# EAGLE schematic led16x16 (EAGLE 5.06)
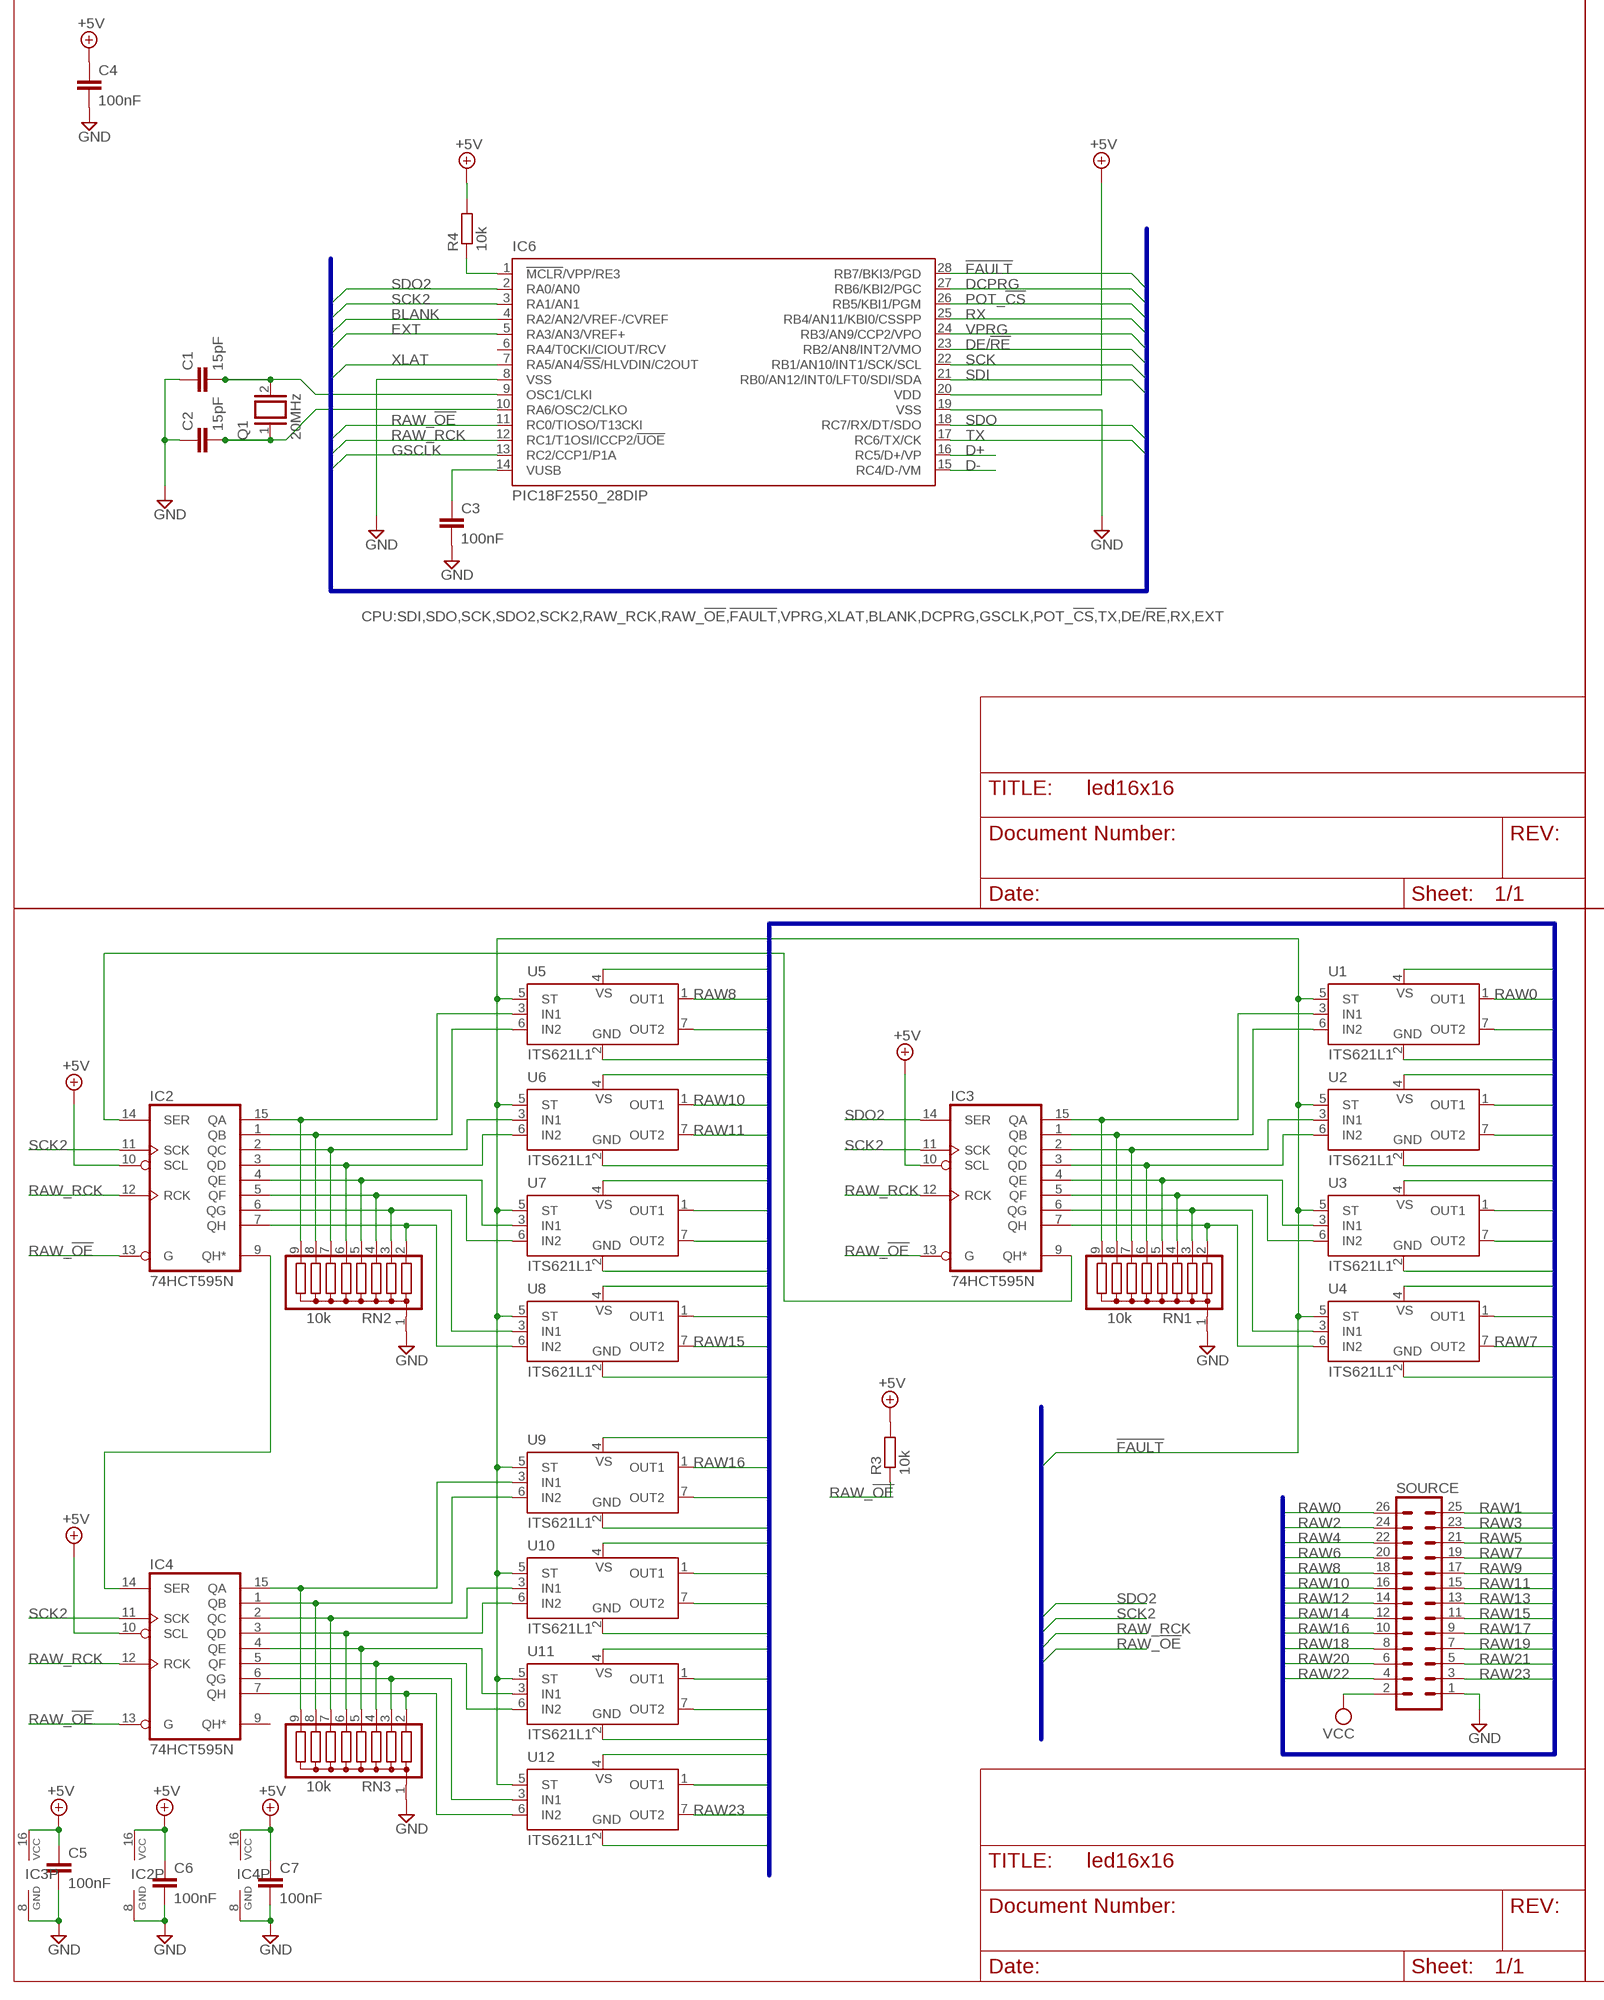
[diagram p0: schematic, sheet 1, part 1 of 2]
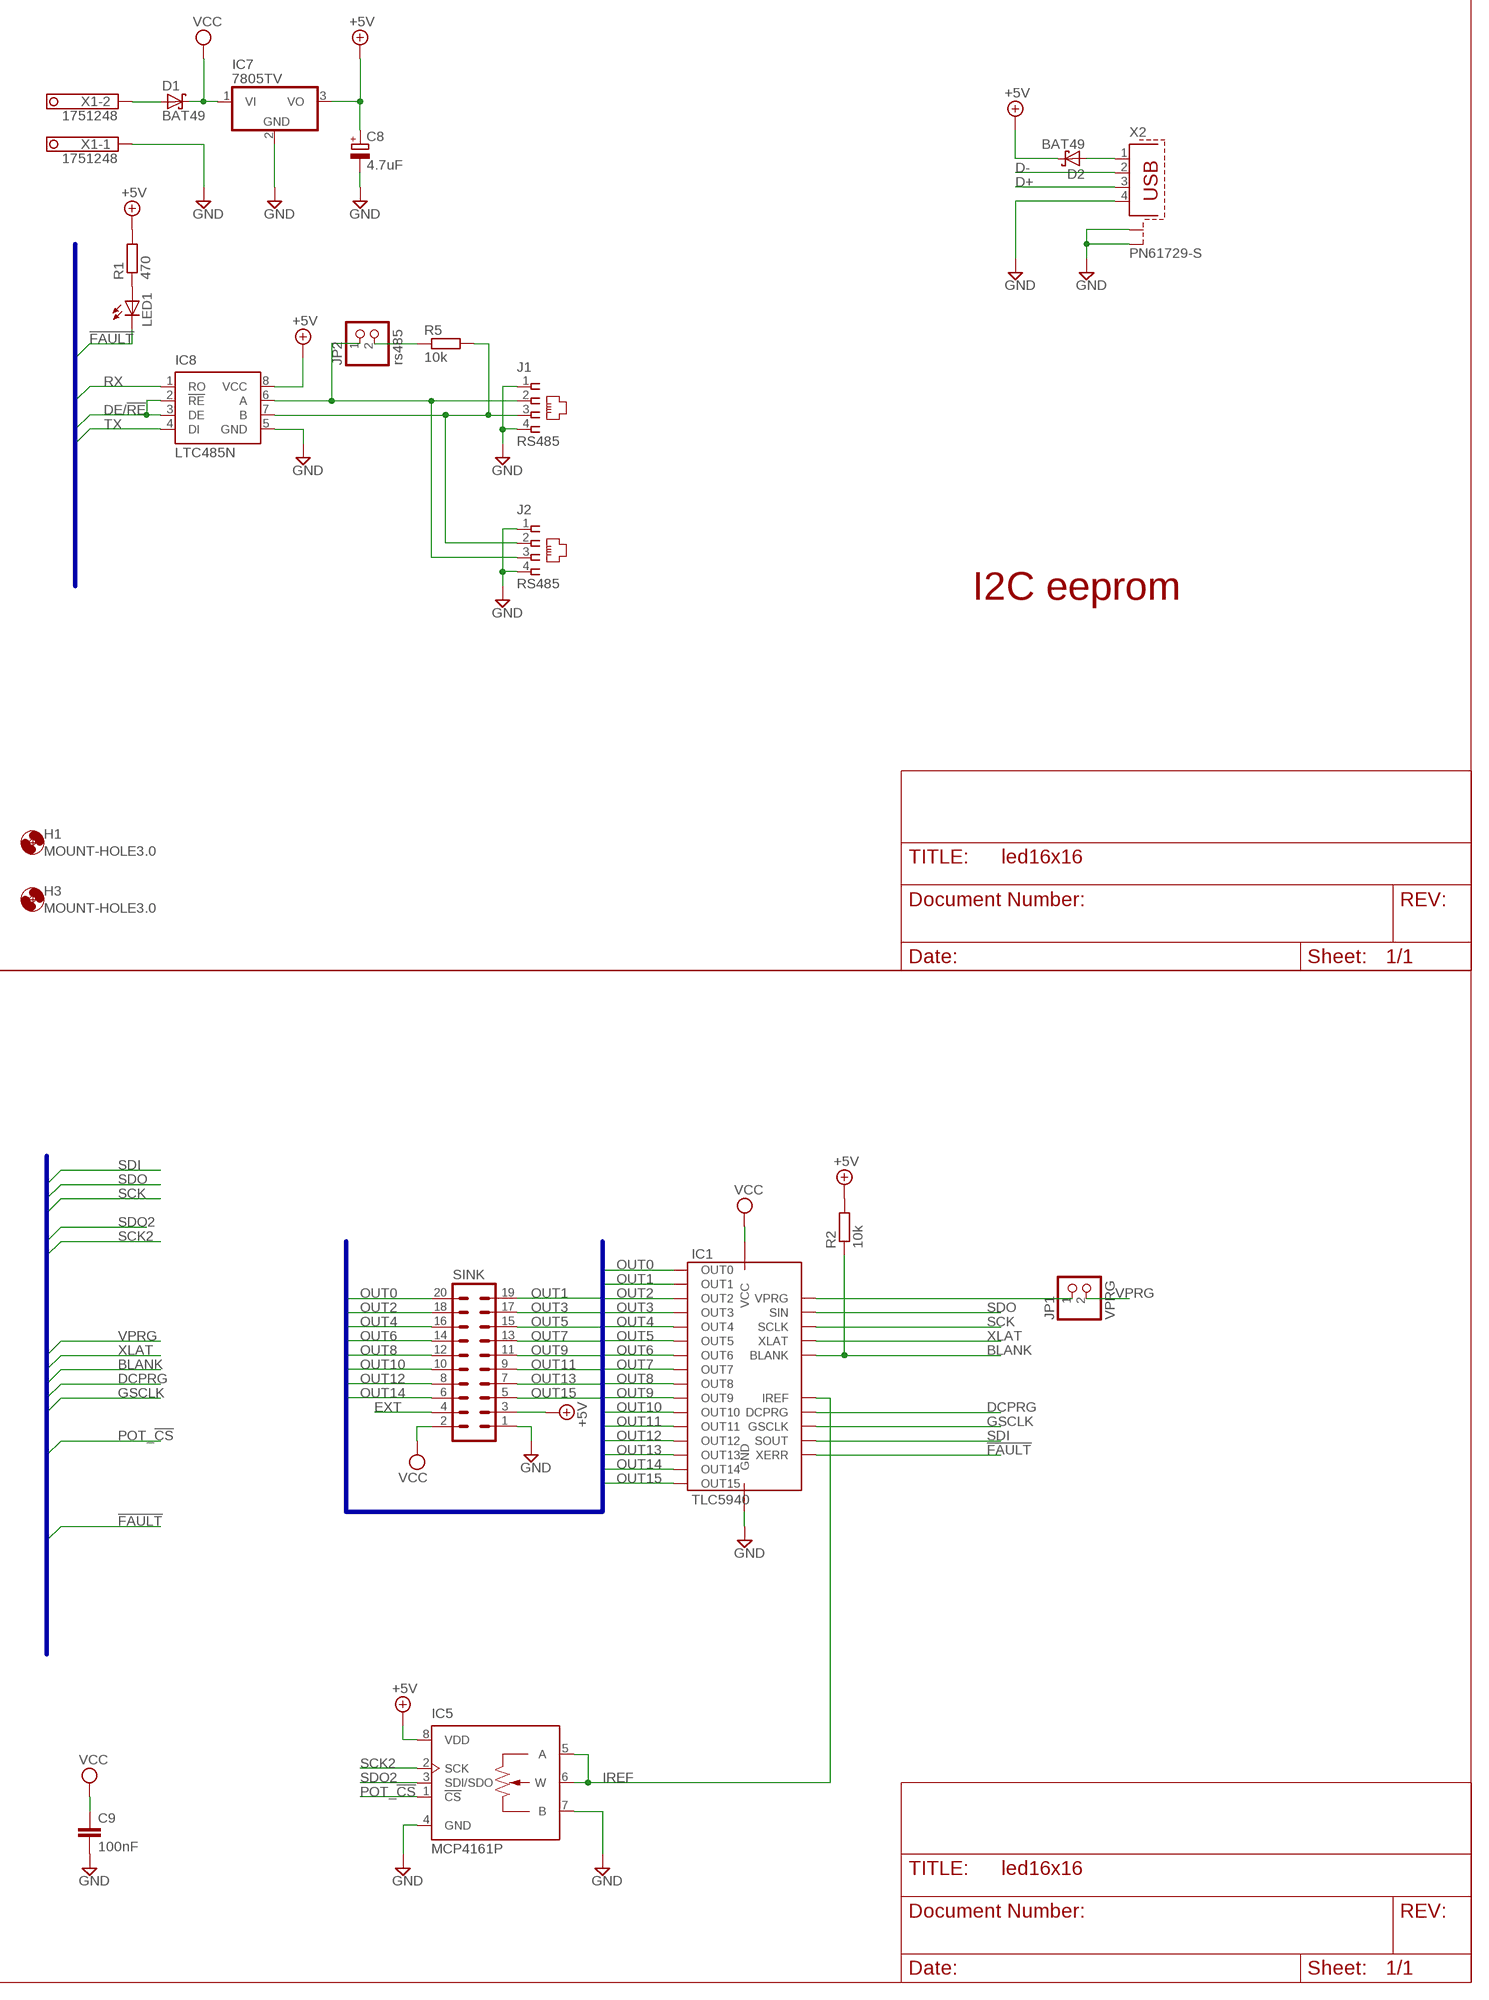
[diagram p1: schematic, sheet 1, part 2 of 2]

## Parts
C1  15pF  C-EU025-024X044  [C025-024X044]
C2  15pF  C-EU025-024X044  [C025-024X044]
C3  100nF  C-EU025-024X044  [C025-024X044]
C4  100nF  C-EU025-024X044  [C025-024X044]
C5  100nF  C-EU025-024X044  [C025-024X044]
C6  100nF  C-EU025-024X044  [C025-024X044]
C7  100nF  C-EU025-024X044  [C025-024X044]
C8  4.7uF  CPOL-EUE5-8.5  [E5-8,5]
C9  100nF  C-EU025-024X044  [C025-024X044]
D1  BAT49  [DO41-10]
D2  BAT49  [DO41-10]
H1  MOUNT-HOLE3.0  [3,0]
H3  MOUNT-HOLE3.0  [3,0]
IC1  TLC5940  IC-PACKAGE_DIL28-3  [IC-PACKAGE_DIL28-3]
IC2  74HCT595N  [DIL16]
IC3  74HCT595N  [DIL16]
IC4  74HCT595N  [DIL16]
IC5  MCP4161P  [DIL08]
IC6  PIC18F2550_28DIP  [DIL28-3]
IC7  7805TV  [TO220V]
IC8  LTC485N  [DIL08]
J1  RS485  520250-2  [520250-2]
J2  RS485  520250-2  [520250-2]
JP1  VPRG  PINHD-1X02_2.54  [1X02]
JP2  rs485  PINHD-1X02_2.54  [1X02]
LED1  LED5MM  [LED5MM]
Q1  20MHz  XTAL/S  [QS]
R1  470  R-EU_0207/10  [0207/10]
R2  10k  R-EU_0207/10  [0207/10]
R3  10k  R-EU_0207/10  [0207/10]
R4  10k  R-EU_0207/10  [0207/10]
R5  10k  R-EU_0207/10  [0207/10]
RN1  10k  G08R  [SIL9]
RN2  10k  G08R  [SIL9]
RN3  10k  G08R  [SIL9]
SINK  ML203ML  [3M_20L]
SOURCE  ML263ML  [3M_26L]
U1  ITS621L1  [ITS621L1]
U2  ITS621L1  [ITS621L1]
U3  ITS621L1  [ITS621L1]
U4  ITS621L1  [ITS621L1]
U5  ITS621L1  [ITS621L1]
U6  ITS621L1  [ITS621L1]
U7  ITS621L1  [ITS621L1]
U8  ITS621L1  [ITS621L1]
U9  ITS621L1  [ITS621L1]
U10  ITS621L1  [ITS621L1]
U11  ITS621L1  [ITS621L1]
U12  ITS621L1  [ITS621L1]
X1  1751248  [1751248]
X2  PN61729-S  [PN61729-S]

## Nets
!FAULT: IC1.16(XERR) IC6.28(RB7/BKI3/PGD) LED1.K(C) U1.5(ST) U2.5(ST) U3.5(ST) U4.5(ST) U5.5(ST) U6.5(ST) U7.5(ST) U8.5(ST) U9.5(ST) U10.5(ST) U11.5(ST) U12.5(ST)
+5V: C4.1 C5.1 C6.1 C7.1 C8.+ D2.C IC2.10(SCL) IC2.16(VCC) IC3.10(SCL) IC3.16(VCC) IC4.10(SCL) IC4.16(VCC) IC5.8(VDD) IC6.20(VDD) IC7.3(VO) IC8.8(VCC) R1.2 R2.2 R3.2 R4.2 SINK.3
BLANK: IC1.23(BLANK) IC6.4(RA2/AN2/VREF-/CVREF) R2.1
D+: IC6.16(RC5/D+/VP) X2.3
D-: IC6.15(RC4/D-/VM) X2.2
DCPRG: IC1.19(DCPRG) IC6.27(RB6/KBI2/PGC)
DE/!RE: IC6.23(RB2/AN8/INT2/VMO) IC8.2(!RE) IC8.3(DE)
EXT: IC6.5(RA3/AN3/VREF+) SINK.4
GND: C1.1 C2.1 C3.2 C4.2 C5.2 C6.2 C7.2 C8.- C9.2 IC1.22(GND) IC2.8(GND) IC3.8(GND) IC4.8(GND) IC5.4(GND) IC5.7(B) IC6.8(VSS) IC6.19(VSS) IC7.2(GND) IC8.5(GND) J1.1 J1.4 J2.1 J2.4 RN1.1 RN2.1 RN3.1 SINK.1 SOURCE.1 U1.2(GND) U2.2(GND) U3.2(GND) U4.2(GND) U5.2(GND) U6.2(GND) U7.2(GND) U8.2(GND) U9.2(GND) U10.2(GND) U11.2(GND) U12.2(GND) X1.1 X2.4 X2.S1 X2.S2
GSCLK: IC1.18(GSCLK) IC6.13(RC2/CCP1/P1A)
IREF: IC1.20(IREF) IC5.5(A) IC5.6(W)
N$1: D1.A X1.2
N$2: IC2.15(QA) RN2.9 U5.3(IN1)
N$3: IC3.15(QA) RN1.9 U1.3(IN1)
N$4: IC3.1(QB) RN1.8 U1.6(IN2)
N$5: IC3.2(QC) RN1.7 U2.3(IN1)
N$6: IC3.3(QD) RN1.6 U2.6(IN2)
N$7: IC3.7(QH) RN1.2 U4.6(IN2)
N$8: IC3.6(QG) RN1.3 U4.3(IN1)
N$9: IC3.5(QF) RN1.4 U3.6(IN2)
N$10: IC3.4(QE) RN1.5 U3.3(IN1)
N$11: IC2.1(QB) RN2.8 U5.6(IN2)
N$12: IC2.2(QC) RN2.7 U6.3(IN1)
N$13: IC2.3(QD) RN2.6 U6.6(IN2)
N$14: IC2.4(QE) RN2.5 U7.3(IN1)
N$15: IC2.5(QF) RN2.4 U7.6(IN2)
N$16: IC2.6(QG) RN2.3 U8.3(IN1)
N$17: IC2.7(QH) RN2.2 U8.6(IN2)
N$18: IC4.3(QD) RN3.6 U10.6(IN2)
N$19: IC4.2(QC) RN3.7 U10.3(IN1)
N$20: IC4.1(QB) RN3.8 U9.6(IN2)
N$21: IC4.15(QA) RN3.9 U9.3(IN1)
N$22: IC4.4(QE) RN3.5 U11.3(IN1)
N$23: IC4.5(QF) RN3.4 U11.6(IN2)
N$24: IC4.6(QG) RN3.3 U12.3(IN1)
N$25: IC4.7(QH) RN3.2 U12.6(IN2)
N$26: C3.1 IC6.14(VUSB)
N$27: IC2.9(QH*) IC4.14(SER)
N$28: IC2.14(SER) IC3.9(QH*)
N$29: D2.A X2.1
N$30: IC1.27(VPRG) JP1.1
N$31: IC6.1(!MCLR!/VPP/RE3) R4.1
N$32: IC8.6(A) J1.2 J2.3 JP2.1
N$33: IC8.7(B) J1.3 J2.2 R5.2
N$34: JP2.2 R5.1
N$35: C1.2 IC6.9(OSC1/CLKI) Q1.2
N$36: C2.2 IC6.10(RA6/OSC2/CLKO) Q1.1
N$37: LED1.A R1.1
OUT0: IC1.28(OUT0) SINK.20
OUT1: IC1.1(OUT1) SINK.19
OUT2: IC1.2(OUT2) SINK.18
OUT3: IC1.3(OUT3) SINK.17
OUT4: IC1.4(OUT4) SINK.16
OUT5: IC1.5(OUT5) SINK.15
OUT6: IC1.6(OUT6) SINK.14
OUT7: IC1.7(OUT7) SINK.13
OUT8: IC1.8(OUT8) SINK.12
OUT9: IC1.9(OUT9) SINK.11
OUT10: IC1.10(OUT10) SINK.10
OUT11: IC1.11(OUT11) SINK.9
OUT12: IC1.12(OUT12) SINK.8
OUT13: IC1.13(OUT13) SINK.7
OUT14: IC1.14(OUT14) SINK.6
OUT15: IC1.15(OUT15) SINK.5
POT_!CS: IC5.1(!CS) IC6.26(RB5/KBI1/PGM)
RAW0: SOURCE.26 U1.1(OUT1)
RAW1: SOURCE.25 U1.7(OUT2)
RAW2: SOURCE.24 U2.1(OUT1)
RAW3: SOURCE.23 U2.7(OUT2)
RAW4: SOURCE.22 U3.1(OUT1)
RAW5: SOURCE.21 U3.7(OUT2)
RAW6: SOURCE.20 U4.1(OUT1)
RAW7: SOURCE.19 U4.7(OUT2)
RAW8: SOURCE.18 U5.1(OUT1)
RAW9: SOURCE.17 U5.7(OUT2)
RAW10: SOURCE.16 U6.1(OUT1)
RAW11: SOURCE.15 U6.7(OUT2)
RAW12: SOURCE.14 U7.1(OUT1)
RAW13: SOURCE.13 U7.7(OUT2)
RAW14: SOURCE.12 U8.1(OUT1)
RAW15: SOURCE.11 U8.7(OUT2)
RAW16: SOURCE.10 U9.1(OUT1)
RAW17: SOURCE.9 U9.7(OUT2)
RAW18: SOURCE.8 U10.1(OUT1)
RAW19: SOURCE.7 U10.7(OUT2)
RAW20: SOURCE.6 U11.1(OUT1)
RAW21: SOURCE.5 U11.7(OUT2)
RAW22: SOURCE.4 U12.1(OUT1)
RAW23: SOURCE.3 U12.7(OUT2)
RAW_!OE: IC2.13(G) IC3.13(G) IC4.13(G) IC6.11(RC0/TIOSO/T13CKI) R3.1
RAW_RCK: IC2.12(RCK) IC3.12(RCK) IC4.12(RCK) IC6.12(RC1/T1OSI/ICCP2/!UOE)
RX: IC6.25(RB4/AN11/KBI0/CSSPP) IC8.1(RO)
SCK: IC1.25(SCLK) IC6.22(RB1/AN10/INT1/SCK/SCL)
SCK2: IC2.11(SCK) IC3.11(SCK) IC4.11(SCK) IC5.2(SCK) IC6.3(RA1/AN1)
SDI: IC1.17(SOUT) IC6.21(RB0/AN12/INT0/LFT0/SDI/SDA)
SDO: IC1.26(SIN) IC6.18(RC7/RX/DT/SDO)
SDO2: IC3.14(SER) IC5.3(SDI/SDO) IC6.2(RA0/AN0)
TX: IC6.17(RC6/TX/CK) IC8.4(DI)
VCC: C9.1 D1.C IC1.21(VCC) IC7.1(VI) SINK.2 SOURCE.2 U1.4(VS) U2.4(VS) U3.4(VS) U4.4(VS) U5.4(VS) U6.4(VS) U7.4(VS) U8.4(VS) U9.4(VS) U10.4(VS) U11.4(VS) U12.4(VS)
VPRG: IC6.24(RB3/AN9/CCP2/VPO) JP1.2
XLAT: IC1.24(XLAT) IC6.7(RA5/AN4/!SS!/HLVDIN/C2OUT)
Unconnected: IC4.9(QH*) IC6.6(RA4/T0CKI/CIOUT/RCV)

## Buses
OUT[0..15]
RAW[0..23],GND,VCC
CPU:SDI,SDO,SCK,SDO2,SCK2,RAW_RCK,RAW_!OE,!FAULT,VPRG,XLAT,BLANK,DCPRG,GSCLK,POT_!CS,TX
CPU:SDI,SDO,SCK,SDO2,SCK2,RAW_RCK,RAW_!OE,!FAULT,VPRG,XLAT,BLANK,DCPRG,GSCLK,POT_!CS,TX,DE/!RE,RX,EXT

## Notes on the sheet
- I2C eeprom

## Library data of the parts
C1-C7 C9 = rcl2:C-EU: CAPACITOR, European symbol
C8 = rcl:CPOL-EU: POLARIZED CAPACITOR, European symbol
D1 D2 = diode:BAT49: DIODE small signal diode
H1 H3 = holes:MOUNT-HOLE: MOUNTING HOLE with drill center marker
IC1 = TLC5940:IC-PACKAGE_DIL28: Dual In Line
IC2-IC4 = 74xx-eu:74*595: 8-bit SHIFT REGISTER, output latch
IC5 = MCP4161:MCP4161: Digital POTENTIOMETER
IC6 = microchip:PIC18F2*_28: USB Microcontrollers with nanoWatt Technology High-Performance, Enhanced Flash, 28/40/44-Pin, Source: http://ww1.microchip.com/downloads/en/devicedoc/39632c.pdf
IC7 = linear:78*: Positive VOLTAGE REGULATOR Source: http://cache.national.com/ds/LM/LM78L05.pdf http://www.fairchildsemi.com/ds/LM/LM7805.pdf
IC8 = linear-technology:LTC485: Low Power RS485 Interface Transceiver Source: http://www.linear.com/pc/downloadDocument.do?navId=H0,C1,C1007,C1017,P2064,D1718; OC_FARNELL: unknown; OC_NEWARK: unknown
J1 J2 = con-amp:520250-2: AMP connector
JP1 JP2 = pinhead-2:PINHD-1X02: PIN HEADER
LED1 = led:LED: LED OSRAM: - CHIPLED LG R971, LG N971, LY N971, LG Q971, LY Q971, LO R971, LY R971 LH N974, LH R974 LS Q976, LO Q976, LY Q976 LO Q996 - Hyper CHIPLED LW Q18S LB Q993, LB Q99A, LB R99A - SideLED LS A670, LO A670, LY A670, LG A670, LP A670 LB A673, LV A673, LT A673, LW A673 LH A674 LY A675 LS A676, LA A676, LO A676, LY A676, LW A676 LS A679, LY A679, LG A679 - Hyper Micro SIDELED® LS Y876, LA Y876, LO Y876, LY Y876 LT Y87S - SmartLED LW L88C, LW L88S LB L89C, LB L89S, LG L890 LS L89K, LO L89K, LY L89K LS L896, LA L896, LO L896, LY L896 - TOPLED LS T670, LO T670, LY T670, LG T670, LP T670 LSG T670, LSP T670, LSY T670, LOP T670, LYG T670 LG T671, LOG T671, LSG T671 LB T673, LV T673, LT T673, LW T673 LH T674 LS T676, LA T676, LO T676, LY T676, LB T676, LH T676, LSB T676, LW T676 LB T67C, LV T67C, LT T67C, LS T67K, LO T67K, LY T67K, LW E67C LS E67B, LA E67B, LO E67B, LY E67B, LB E67C, LV E67C, LT E67C LW T67C LS T679, LY T679, LG T679 LS T770, LO T770, LY T770, LG T770, LP T770 LB T773, LV T773, LT T773, LW T773 LH T774 LS E675, LA E675, LY E675, LS T675 LS T776, LA T776, LO T776, LY T776, LB T776 LHGB T686 LT T68C, LB T68C - Hyper Mini TOPLED® LB M676 - Mini TOPLED Santana® LG M470 LS M47K, LO M47K, LY M47K Source: http://www.osram.convergy.de LUXEON: - LUMILED® LXK2-PW12-R00, LXK2-PW12-S00, LXK2-PW14-U00, LXK2-PW14-V00 LXK2-PM12-R00, LXK2-PM12-S00, LXK2-PM14-U00 LXK2-PE12-Q00, LXK2-PE12-R00, LXK2-PE12-S00, LXK2-PE14-T00, LXK2-PE14-U00 LXK2-PB12-K00, LXK2-PB12-L00, LXK2-PB12-M00, LXK2-PB14-N00, LXK2-PB14-P00, LXK2-PB14-Q00 LXK2-PR12-L00, LXK2-PR12-M00, LXK2-PR14-Q00, LXK2-PR14-R00 LXK2-PD12-Q00, LXK2-PD12-R00, LXK2-PD12-S00 LXK2-PH12-R00, LXK2-PH12-S00 LXK2-PL12-P00, LXK2-PL12-Q00, LXK2-PL12-R00 Source: www.luxeon.com KINGBRIGHT: KA-3528ASYC Source: www.kingbright.com
Q1 = special:XTAL/S: CRYSTAL
R1-R5 = rcl2:R-EU_: RESISTOR, European symbol
RN1-RN3 = resistor-sil:G08R: SIL RESISTOR
SINK = con-harting-ml:ML20: HARTING; OC_FARNELL: unknown; OC_NEWARK: unknown
SOURCE = con-harting-ml:ML26: HARTING
U1-U12 = ITS621L1:ITS621L1
X1 = con-phoenix-350:1751248: MKDS 1/ 2-3,5 Printklemme Nennstrom: 10 A Bemessungsspannung: 160 V Raster: 3,5 mm Polzahl: 2 Montageart: Löten Anschlussart: Schraubanschluss Anschlussrichtung vom Leiter zur Platine: 0° Source: http://eshop.phoenixcontact.com .. 1751248.pdf
X2 = con-berg:PN61729-S: BERG USB connector